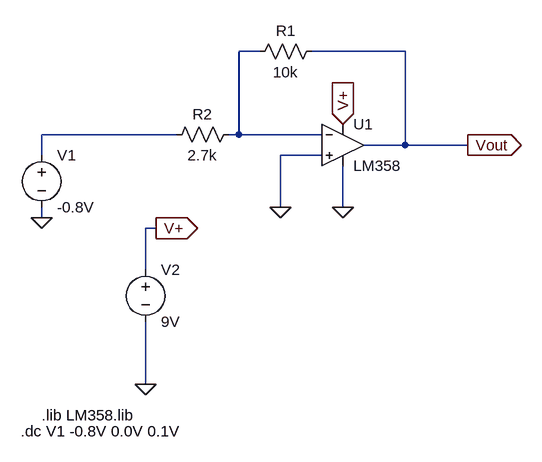
[diagram p0: schematic lm358-test.asc]
lm358-test.asc, the LTspice schematic file:
Version 4
SHEET 1 880 680
WIRE 336 -272 304 -272
WIRE 560 -272 416 -272
WIRE 208 -144 0 -144
WIRE 304 -144 304 -272
WIRE 304 -144 288 -144
WIRE 432 -144 304 -144
WIRE 560 -128 560 -272
WIRE 560 -128 496 -128
WIRE 656 -128 560 -128
WIRE 0 -112 0 -144
WIRE 432 -112 368 -112
WIRE 368 -32 368 -112
WIRE 464 -32 464 -96
WIRE 0 -16 0 -32
WIRE 176 0 160 0
WIRE 160 64 160 0
WIRE 160 240 160 144
FLAG 464 -160 V+
IOPIN 464 -160 In
FLAG 464 -32 0
FLAG 0 -16 0
FLAG 160 240 0
FLAG 176 0 V+
IOPIN 176 0 Out
FLAG 656 -128 Vout
IOPIN 656 -128 Out
FLAG 368 -32 0
SYMBOL OpAmps\\opamp2 464 -192 R0
SYMATTR InstName U1
SYMATTR Value LM358
SYMBOL res 432 -288 R90
WINDOW 0 0 56 VBottom 2
WINDOW 3 32 56 VTop 2
SYMATTR InstName R1
SYMATTR Value 10k
SYMBOL res 304 -160 R90
WINDOW 0 0 56 VBottom 2
WINDOW 3 32 56 VTop 2
SYMATTR InstName R2
SYMATTR Value 2.7k
SYMBOL voltage 0 -128 R0
SYMATTR InstName V1
SYMATTR Value -0.8V
SYMBOL voltage 160 48 R0
SYMATTR InstName V2
SYMATTR Value 9V
TEXT 0 288 Left 2 !.lib LM358.lib
TEXT -32 312 Left 2 !.dc V1 -0.8V 0.0V 0.1V

The netlist it stands for:
* lm358-test.asc
XU1 0 N001 V+ 0 Vout LM358  ; pins In+ In- V+ V- OUT
R1 Vout N001 10k
R2 N001 N002 2.7k
V1 N002 0 -0.8V
V2 V+ 0 9V
.lib LM358.lib
.dc V1 -0.8V 0.0V 0.1V
.backanno
.end